# EAGLE design mechanical_tactile_switch_board (EAGLE 8.4.1)
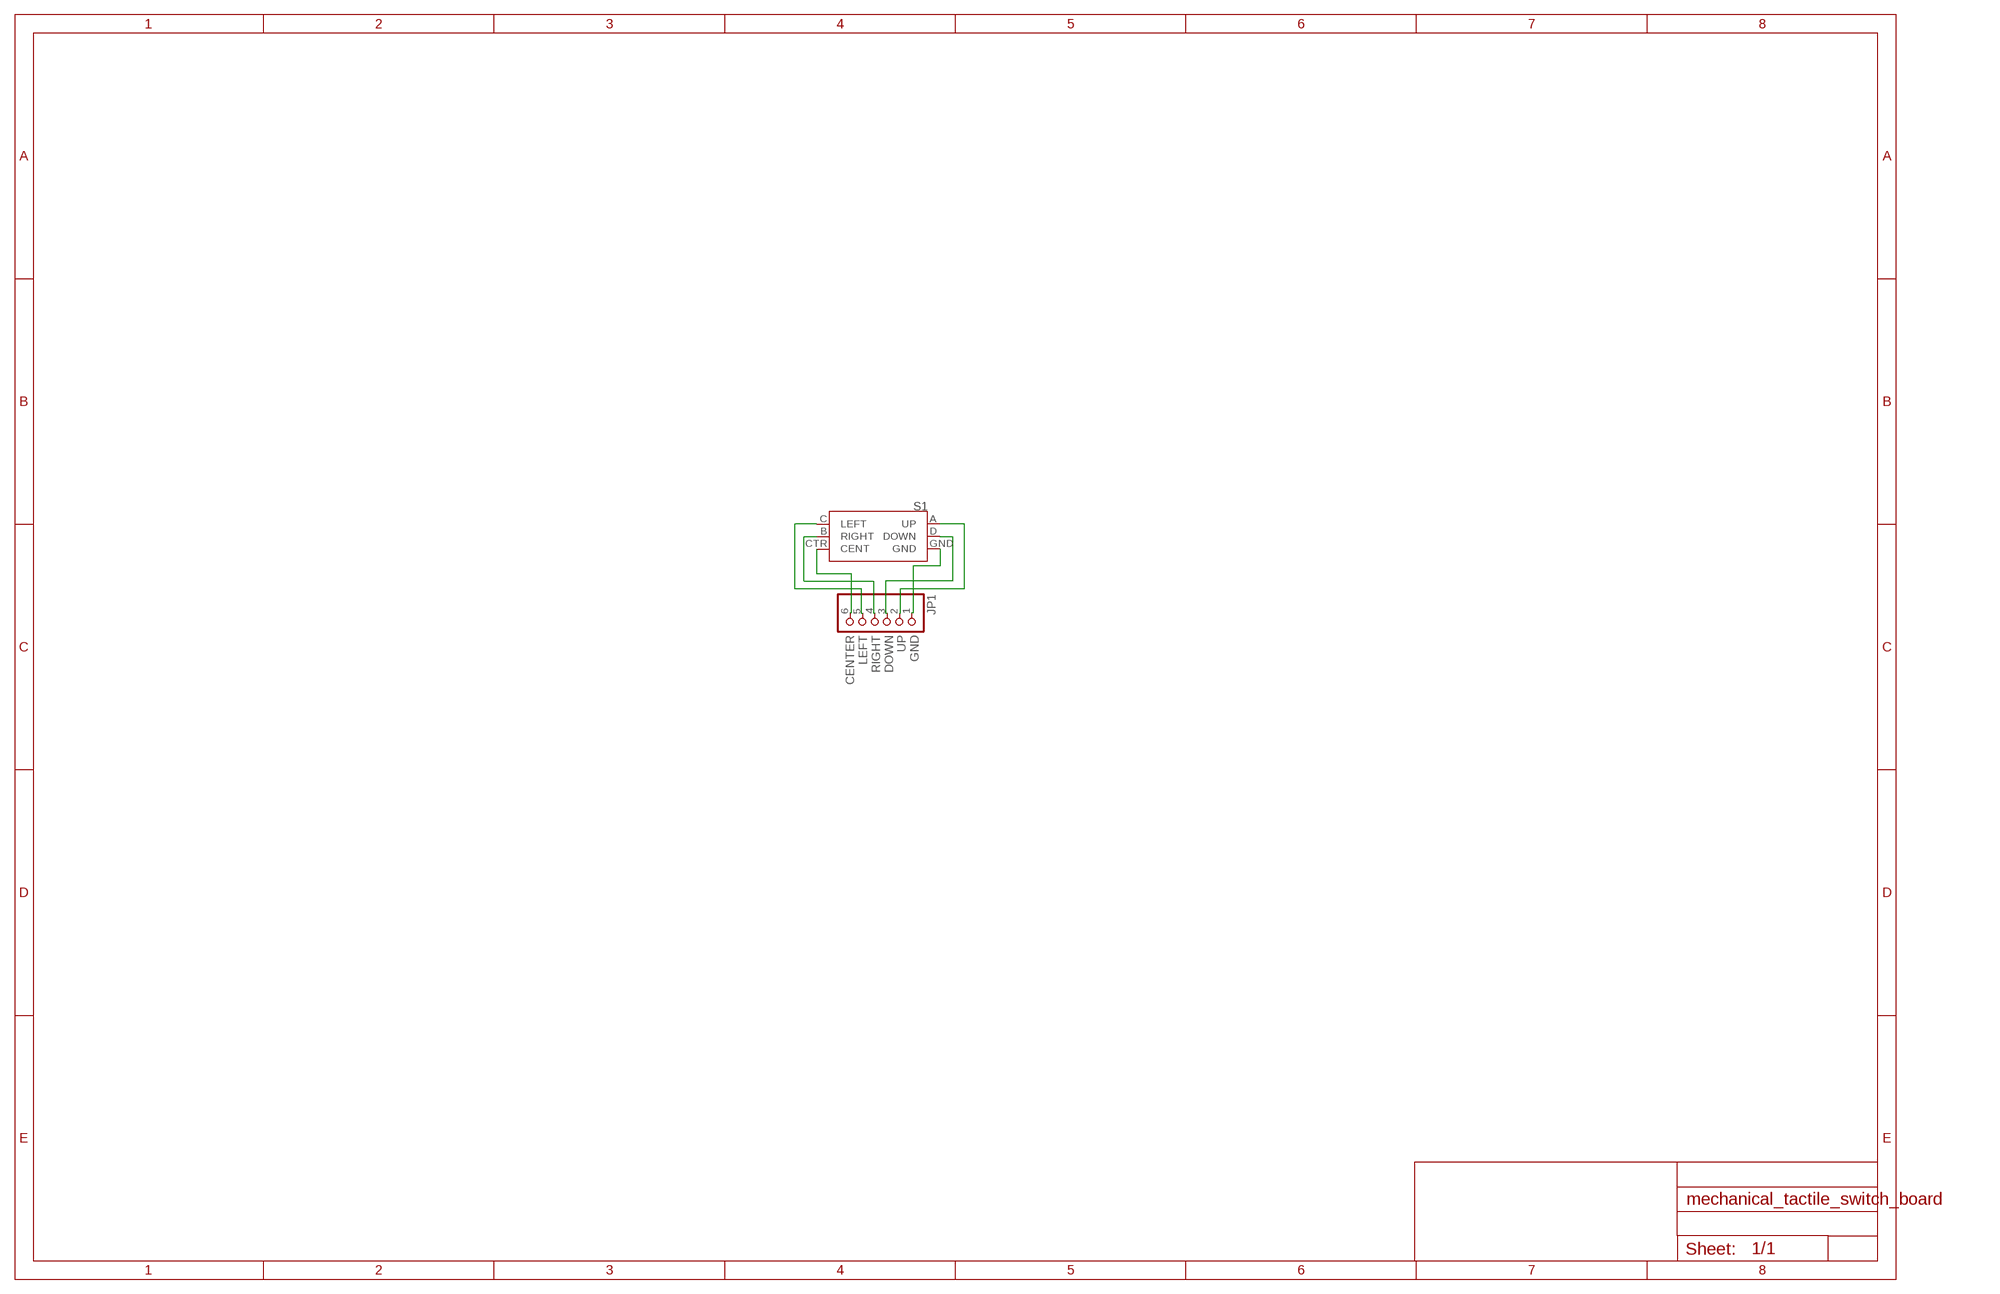
[diagram p0: schematic, sheet 1]

## Parts
JP1  PINHD-1X6  [1X06]
S1  JOYSTICK_MINI  [JOYSTICK_MINI]

## Nets
GND: JP1.1 S1.GND
N$1: JP1.4 S1.B(RIGHT)
N$2: JP1.6 S1.CTR(CENT)
N$3: JP1.5 S1.C(LEFT)
N$7: JP1.3 S1.D(DOWN)
N$8: JP1.2 S1.A(UP)

## Notes on the sheet
- CENTER
  LEFT
  RIGHT
  DOWN
  UP
  GND

## Library data of the parts
JP1 = pinhead:PINHD-1X6: PIN HEADER
S1 = SparkFun-Switches:JOYSTICK_MINI: Small Tactile Joystick w/ Select Switch A 5-way tactile switch allows for a joystick-like interface in a very small package. Part #: 4UCON SF303GJ26 SparkFun Products 5-way Tactile Switch <https://www.sparkfun.com/products/10063> (COM-10063) Used on SparkFun Block for Intel® Edison - OLED <https://www.sparkfun.com/products/13035> (DEV-13035) Used on CAN-BUS Shield <https://www.sparkfun.com/products/13262> (DEV-13262); PROD_ID: SWCH-09905; SF_SKU: COM-10063

## Board
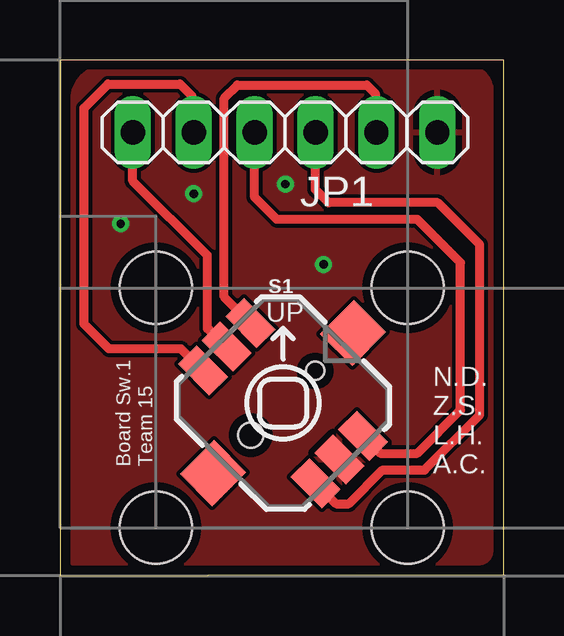
[diagram p1: board, top side]
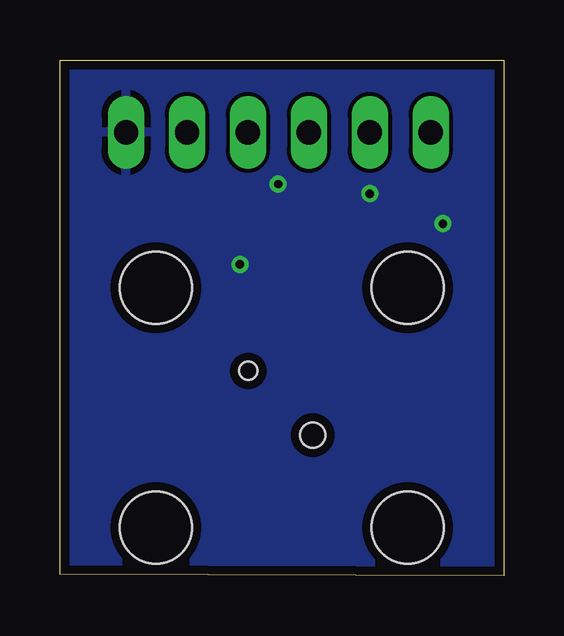
[diagram p2: board, bottom side, seen from below]

Size 18.5 x 21.5 mm. Coordinates in mm from the lower left corner, seen from the top.
Outline: 0,0 18.5,0.05 18.5,21.5 0,21.5 0,0
Copper layers (1*16): Top 0.0356mm / dielectric 1.5011mm / Bottom 0.0356mm
Design rules "LaenPCBOrder": minimum track width 6mil, minimum drill 13mil, track to track 6mil, track to pad 6mil, pad to pad 6mil, via to via 6mil, smd to smd 6mil, copper to edge 15mil, drill to drill 6mil, minimum pad ring 7mil, minimum via ring 7mil, stop-mask expansion 3mil, vias tented up to drill 0mil, thermal gap 10mil
Holes 3 mm at 4,2 14.5,2 14.5,12 4,12

### Footprints (pad centres in the part's own frame; a part is rotated, then mirrored left to right if it is on the bottom)
1X06 = drill 1.016 long: 1 -6.35,0; 2 -3.81,0; 3 -1.27,0; 4 1.27,0; 5 3.81,0; 6 6.35,0
JOYSTICK_MINI = smd 1.85 x 1.1: A -3.325,1.4; B 3.325,1.4; C -3.325,-1.4; CTR -3.325,0; D 3.325,-1.4; GND 3.325,0 | smd 1.9 x 2: NC 0,4.13; NC@0 0,-4.13 | hole 0.75: 0,1.9 | hole 1.05: 0,-1.9

### Placement (x,y rotation side)
JP1  9.39,18.48 180 top
S1  9.3,7.19 315 top

### Tracks (layer width: path | path; a pad name or v marks a point on that pad's centre or on a via)
GND  (via drill 0.35)
  other vias: 5.58,15.92 2.53,14.67 11,12.97 9.4,16.32
  pour Top: 0.5,0.5 17.5,0.5 arc90 18,1 18,20 arc90 17.15,21.25 2.15,21.25 arc90 0.5,20
  pour Bottom: 18,21 0.5,21 0.5,0.5 18,0.5
N$1
  Top 0.381: S1.B 13.38,5.1 14.9,5.1 16.7,6.9 16.7,13.05 14.9,14.85 9.05,14.85 8.12,15.78 JP1.4
N$2
  Top 0.381: S1.CTR 6.15,10.3 6.15,13.35 3.04,16.45 JP1.6
N$3
  Top 0.152: 5.5,18.56 JP1.5
  Top 0.381: S1.C 5.05,9.45 2.05,9.45 1,10.5 1,19.5 2,20.5 5,20.5 5.5,20 5.5,18.56
N$7
  Top 0.152: 10.65,18.42 JP1.3
  Top 0.381: S1.D 11.52,3 12.05,3 13.45,4.4 15.2,4.4 17.5,6.7 17.5,13.8 15.75,15.55 11.2,15.55 10.65,16.1 10.65,18.42
N$8
  Top 0.152: 13.15,18.53 JP1.2
  Top 0.381: S1.A 6.85,11.62 6.85,19.9 7.4,20.45 12.8,20.45 13.15,20.1 13.15,18.53

### Text on the board
tPlace: Board Sw.1 / Team 15 | N.D. / Z.S. / L.H. / A.C.